# EasyEDA Pro project 计算器原理图_带PCB（嘉立创EDA专业版）.eprj

# Schematic 计算器原理图
Board Name: 计算器原理图; Create Date: 2024-10-13; Page Name: 计算器原理图; Project Name: 计算器原理图_带PCB（嘉立创EDA专业版）; Schematic Name: 计算器原理图; Update Date: 2025-01-02; Address1: *; Address2: *; Address3: *; Address4: *; Application_BuildNumber: *; ApprovedBy: *; Author: *; CheckedBy: *; CompanyName: *; CurrentDate: *; CurrentTime: *; Date: *; DocumentFullPathAndName: *; DocumentName: *; DocumentNumber: *; DrawnBy: *; Engineer: *; ImagePath: *; ModifiedDate: *; Organization: *; ProjectName: *; Revision: *; Rule: *; SheetNumber: 2; SheetTotal: 2; Time: *; Title: *
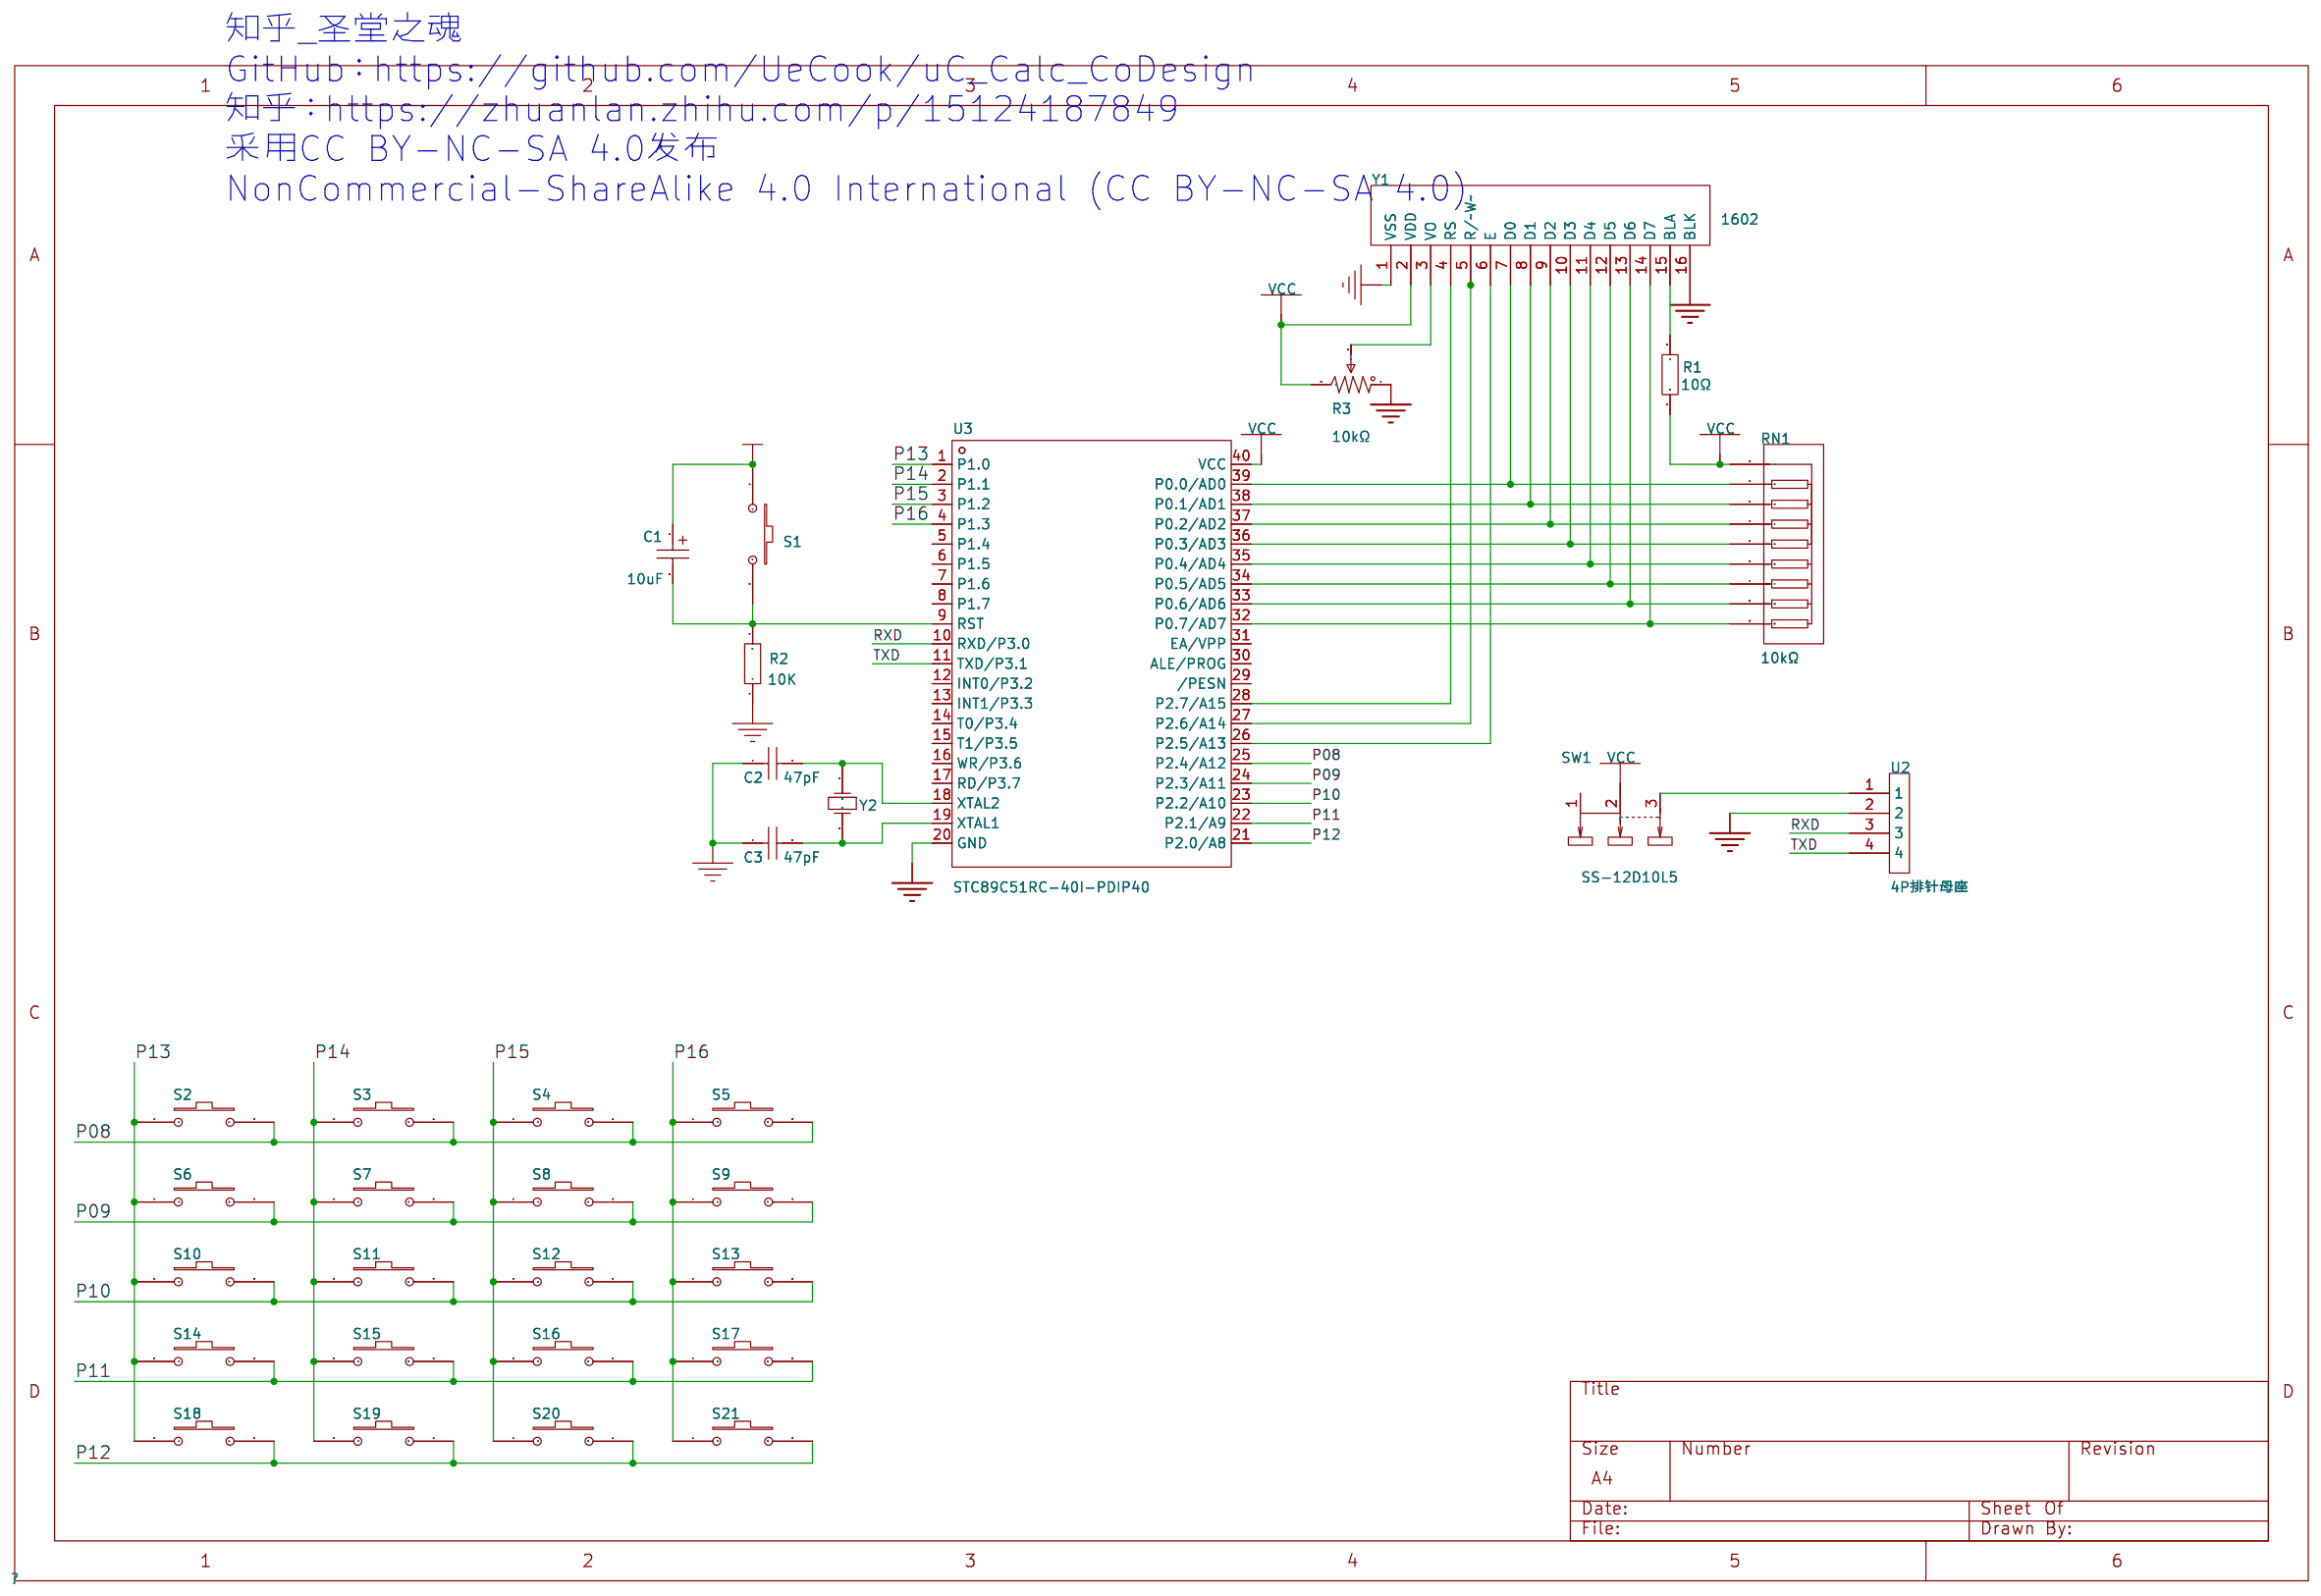
[diagram p0: schematic sheet]

## Parts
C1  10uF  [C0805]
C2  47pF  [C0805]
C3  47pF  [C0805]
R1  10Ω  [C0805]
R2  10K  [C0805]
R3  10kΩ  [RES-ADJ-TH_3362P]
RN1  10kΩ  [RES-ARRAY-TH_9P-P2.54-D1.0]
S1  按键  [SW-TH_4P-L6.0-W6.0-P4.50-LS6.5]
S2  按键  [SW-TH_4P-L6.0-W6.0-P4.50-LS6.5]
S3  按键  [SW-TH_4P-L6.0-W6.0-P4.50-LS6.5]
S4  按键  [SW-TH_4P-L6.0-W6.0-P4.50-LS6.5]
S5  按键  [SW-TH_4P-L6.0-W6.0-P4.50-LS6.5]
S6  按键  [SW-TH_4P-L6.0-W6.0-P4.50-LS6.5]
S7  按键  [SW-TH_4P-L6.0-W6.0-P4.50-LS6.5]
S8  按键  [SW-TH_4P-L6.0-W6.0-P4.50-LS6.5]
S9  按键  [SW-TH_4P-L6.0-W6.0-P4.50-LS6.5]
S10  按键  [SW-TH_4P-L6.0-W6.0-P4.50-LS6.5]
S11  按键  [SW-TH_4P-L6.0-W6.0-P4.50-LS6.5]
S12  按键  [SW-TH_4P-L6.0-W6.0-P4.50-LS6.5]
S13  按键  [SW-TH_4P-L6.0-W6.0-P4.50-LS6.5]
S14  按键  [SW-TH_4P-L6.0-W6.0-P4.50-LS6.5]
S15  按键  [SW-TH_4P-L6.0-W6.0-P4.50-LS6.5]
S16  按键  [SW-TH_4P-L6.0-W6.0-P4.50-LS6.5]
S17  按键  [SW-TH_4P-L6.0-W6.0-P4.50-LS6.5]
S18  按键  [SW-TH_4P-L6.0-W6.0-P4.50-LS6.5]
S19  按键  [SW-TH_4P-L6.0-W6.0-P4.50-LS6.5]
S20  按键  [SW-TH_4P-L6.0-W6.0-P4.50-LS6.5]
S21  按键  [SW-TH_4P-L6.0-W6.0-P4.50-LS6.5]
SW1  SS-12D10L5  [SW-TH_SS-12D10L5]
U2  4P排针母座  [HDR-TH_4P-P2.54-V-M-4]
U3  STC89C51RC-40I-PDIP40  [DIP-40_L52.3-W13.9-P2.54-LS15.2-BL]
Y1  1602  [LCD1602_1]
Y2  XTAL  [OSC-TH_L10.0-W4.5-P5.00]

## Library data of the parts
C1 = 10uF: Design Item ID: 电解电容; Library Name: 我的库
C2 C3 = 30P: Design Item ID: 瓷片电容; Library Name: 我的库
R1 = Res2: Resistor; Published: 8-Jun-2000; LatestRevisionDate: 17-Jul-2002; LatestRevisionNote: Re-released for DXP Platform.; PackageReference: AXIAL-0.4; Publisher: Altium Limited; Library Name: Miscellaneous Devices
R2 = 10K: Design Item ID: 电阻; Library Name: 我的库
R3 = 3362P-1-103: LCSC Part Name: 10kΩ ±10%; Supplier Part: C118956; Manufacturer: BOCHEN(博晨); Supplier Footprint: 插件; JLCPCB Part Class: Extended Part; Datasheet: https://atta.szlcsc.com/upload/public/pdf/source/20171114/C118956_15106326650691117445.pdf; Supplier: LCSC; Tolerance: ±10%; Temperature Coefficient: ±250ppm/℃
RN1 = A09-103JP: LCSC Part Name: 10kΩ ±5%; Supplier Part: C8692; Manufacturer: FH(风华); Supplier Footprint: SIP-9-2.54mm; JLCPCB Part Class: Extended Part; Datasheet: https://atta.szlcsc.com/upload/public/pdf/source/20140224/1457706855244.pdf; Supplier: LCSC; Tolerance: ±5%; Power(Watts): 125mW; Temperature Coefficient: ±100ppm/℃; Number of Resistors: 8; Number of Pins: 9
S1-S21 = 按键: Library Name: 我的库
SW1 = SS-12D10L5: LCSC Part Name: 插件大电流拨动开关; Supplier Part: C319012; Manufacturer: XKB Connectivity(中国星坤); Supplier Footprint: 插件; JLCPCB Part Class: Extended Part; Datasheet: https://atta.szlcsc.com/upload/public/pdf/source/20211009/D6412F37AABE6F9459A6EE7FA4DAEADB.pdf; Supplier: LCSC; Current Rating (DC): 3A; Voltage Rating (DC): 125V; Current Rating (AC): 3A; Voltage Rating (AC): 125V; Circuit: 单刀双掷; Mounting Style: 直插; Mechanical Life: 10000; Actuator Color: 黑色; Actuator Style: 矩形柱状; Pin Style: PC引脚; Operating Temperature: -40℃~+85℃; Switch Length: 13mm; Switch Width: 6.8mm; Switch Height: 6.4mm
U2 = 4P排针母座
U3 = STC89C51RC-40I-PDIP40: LCSC Part Name: STC89C51RC-40I-PDIP40 停产; Supplier Part: C29286; Manufacturer: STC(宏晶); Supplier Footprint: DIP-40; JLCPCB Part Class: Extended Part; Datasheet: https://atta.szlcsc.com/upload/public/pdf/source/20210111/C29286_8D18B35F9C74B93E8391CB56D361E797.pdf; Supplier: LCSC
Y1 = 1602: Library Name: 元件库
Y2 = XTAL: Library Name: 我的库

## Nets
GND: C2.1 C3.1 R2.1 R3.1 U2.2 U3.20(GND) Y1.1(VSS) Y1.16(BLK)
VCC: C1.1 R1.1 R3.3 RN1.1 S1.1 SW1.2 U3.40(VCC) Y1.2(VDD)
P08: S2.2 S3.2 S4.2 S5.2 U3.25(P2.4/A12)
P09: S6.2 S7.2 S8.2 S9.2 U3.24(P2.3/A11)
P10: S10.2 S11.2 S12.2 S13.2 U3.23(P2.2/A10)
P11: S14.2 S15.2 S16.2 S17.2 U3.22(P2.1/A9)
P12: S18.2 S19.2 S20.2 S21.2 U3.21(P2.0/A8)
P13: S2.1 S6.1 S10.1 S14.1 S18.1 U3.1(P1.0)
P14: S3.1 S7.1 S11.1 S15.1 S19.1 U3.2(P1.1)
P15: S4.1 S8.1 S12.1 S16.1 S20.1 U3.3(P1.2)
P16: S5.1 S9.1 S13.1 S17.1 S21.1 U3.4(P1.3)
RXD: U2.3 U3.10(RXD/P3.0)
TXD: U2.4 U3.11(TXD/P3.1)
$1N2: C3.2 U3.19(XTAL1) Y2.2(OSC2)
$1N3: C2.2 U3.18(XTAL2) Y2.1(OSC1)
$1N23: C1.2 R2.2 S1.2 U3.9(RST)
$1N53: U3.28(P2.7/A15) Y1.4(RS)
$1N55: U3.26(P2.5/A13) Y1.6(E)
$1N56: RN1.2 U3.39(P0.0/AD0) Y1.7(D0)
$1N57: RN1.3 U3.38(P0.1/AD1) Y1.8(D1)
$1N58: RN1.4 U3.37(P0.2/AD2) Y1.9(D2)
$1N59: RN1.5 U3.36(P0.3/AD3) Y1.10(D3)
$1N60: RN1.6 U3.35(P0.4/AD4) Y1.11(D4)
$1N61: RN1.7 U3.34(P0.5/AD5) Y1.12(D5)
$1N63: RN1.9 U3.32(P0.7/AD7) Y1.14(D7)
$1N2393: RN1.8 U3.33(P0.6/AD6) Y1.13(D6)
$1N4058: SW1.3 U2.1

Not connected (* = marked no-connect by the designer): R1 2; R3 2; SW1 1; U3 5(P1.4) 6(P1.5) 7(P1.6) 8(P1.7) 12(INT0/P3.2) 13(INT1/P3.3) 14(T0/P3.4) 15(T1/P3.5) 16(WR/P3.6) 17(RD/P3.7) 27(P2.6/A14) 29(/PESN) 30(ALE/PROG) 31(EA/VPP); Y1 3(VO) 5(R/~W~) 15(BLA)

## Notes on the sheet
- 知乎_圣堂之魂
  GitHub：https://github.com/UeCook/uC_Calc_CoDesign
  知乎：https://zhuanlan.zhihu.com/p/15124187849
  采用CC BY-NC-SA 4.0发布
  NonCommercial-ShareAlike 4.0 International (CC BY-NC-SA 4.0)

# Schematic 优雅版原理图
Create Date: 2024-10-15; Page Name: P1; Project Name: 计算器原理图_带PCB（嘉立创EDA专业版）; Schematic Name: 优雅版原理图; Update Date: 2025-01-02; Add into BOM: yes; Company: 嘉立创EDA; Convert to PCB: yes; Page Size: A4; Version: V1.0
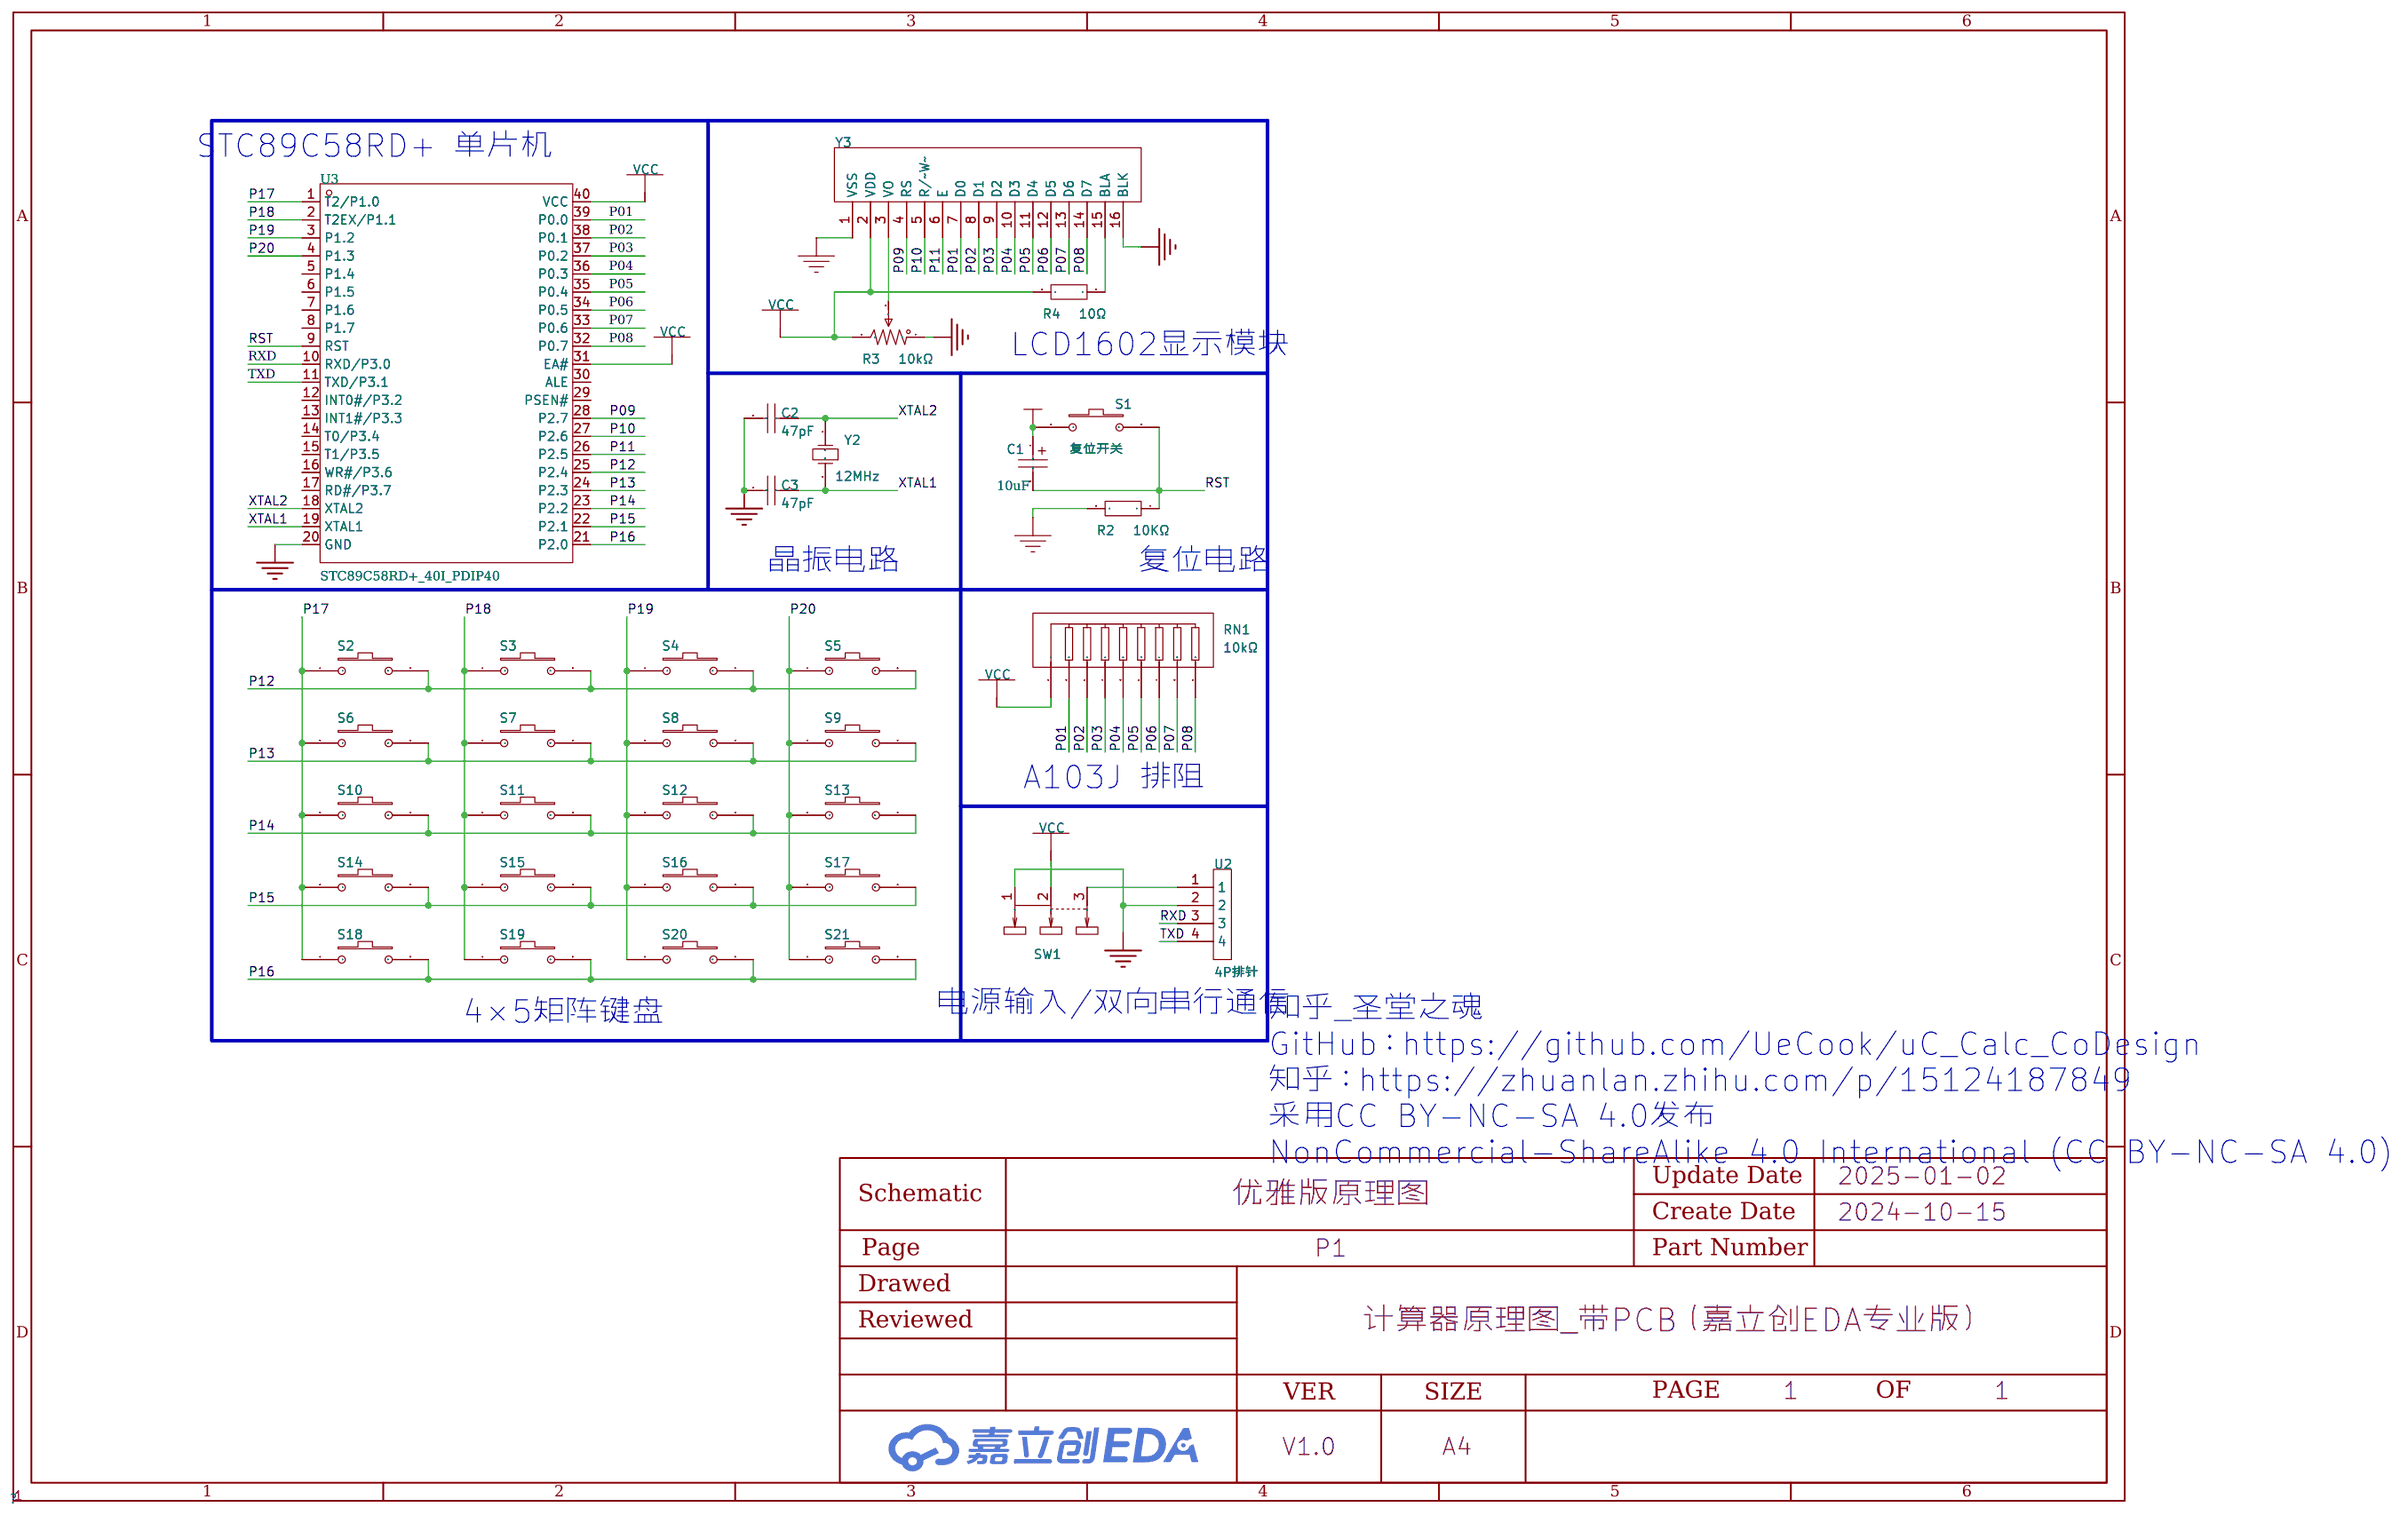
[diagram p1: schematic sheet]

## Parts
C1  10uF  [C0805]
C2  47pF  [C0805]
C3  47pF  [C0805]
R2  10KΩ  [C0805]
R3  10kΩ  [RES-ADJ-TH_3362P]
R4  10Ω  [C0805]
RN1  10kΩ  [RES-ARRAY-TH_9P-P2.54-D1.0]
S1  复位开关  [SW-TH_4P-L6.0-W6.0-P4.50-LS6.5]
S2  按键  [SW-TH_4P-L6.0-W6.0-P4.50-LS6.5]
S3  按键  [SW-TH_4P-L6.0-W6.0-P4.50-LS6.5]
S4  按键  [SW-TH_4P-L6.0-W6.0-P4.50-LS6.5]
S5  按键  [SW-TH_4P-L6.0-W6.0-P4.50-LS6.5]
S6  按键  [SW-TH_4P-L6.0-W6.0-P4.50-LS6.5]
S7  按键  [SW-TH_4P-L6.0-W6.0-P4.50-LS6.5]
S8  按键  [SW-TH_4P-L6.0-W6.0-P4.50-LS6.5]
S9  按键  [SW-TH_4P-L6.0-W6.0-P4.50-LS6.5]
S10  按键  [SW-TH_4P-L6.0-W6.0-P4.50-LS6.5]
S11  按键  [SW-TH_4P-L6.0-W6.0-P4.50-LS6.5]
S12  按键  [SW-TH_4P-L6.0-W6.0-P4.50-LS6.5]
S13  按键  [SW-TH_4P-L6.0-W6.0-P4.50-LS6.5]
S14  按键  [SW-TH_4P-L6.0-W6.0-P4.50-LS6.5]
S15  按键  [SW-TH_4P-L6.0-W6.0-P4.50-LS6.5]
S16  按键  [SW-TH_4P-L6.0-W6.0-P4.50-LS6.5]
S17  按键  [SW-TH_4P-L6.0-W6.0-P4.50-LS6.5]
S18  按键  [SW-TH_4P-L6.0-W6.0-P4.50-LS6.5]
S19  按键  [SW-TH_4P-L6.0-W6.0-P4.50-LS6.5]
S20  按键  [SW-TH_4P-L6.0-W6.0-P4.50-LS6.5]
S21  按键  [SW-TH_4P-L6.0-W6.0-P4.50-LS6.5]
SW1  SS-12D10L5  [SW-TH_SS-12D10L5]
U2  4P排针  [HDR-TH_4P-P2.54-V-M-4]
U3  STC89C58RD+_40I_PDIP40  [DIP-40_L52.0-W13.7-P2.54-LS15.2-BL]
Y2  12MHz  [OSC-TH_L10.0-W4.5-P5.00]
Y3  1602  [LCD1602_1]

## Library data of the parts
C1 = 10uF: Design Item ID: 电解电容; Library Name: 我的库
C2 C3 = CL21C470JBANNNC: LCSC Part Name: 47pF ±5% 50V; Supplier Part: C14857; Manufacturer: SAMSUNG(三星); Supplier Footprint: 0805; JLCPCB Part Class: Basic Part; Datasheet: https://atta.szlcsc.com/upload/public/pdf/source/20160103/1457707672155.pdf; Supplier: LCSC; Tolerance: ±5%; Voltage Rated: 50V; Temperature Coefficient: C0G
R2 = 10K: Design Item ID: 电阻; Library Name: 我的库
R3 = 3362P-1-103: LCSC Part Name: 10kΩ ±10%; Supplier Part: C118956; Manufacturer: BOCHEN(博晨); Supplier Footprint: 插件; JLCPCB Part Class: Extended Part; Datasheet: https://atta.szlcsc.com/upload/public/pdf/source/20171114/C118956_15106326650691117445.pdf; Supplier: LCSC; Tolerance: ±10%; Temperature Coefficient: ±250ppm/℃
R4 = Res2: Resistor; Published: 8-Jun-2000; LatestRevisionDate: 17-Jul-2002; LatestRevisionNote: Re-released for DXP Platform.; PackageReference: AXIAL-0.4; Publisher: Altium Limited; Library Name: Miscellaneous Devices
RN1 = A09-103JP: LCSC Part Name: 10kΩ ±5%; Supplier Part: C8692; Manufacturer: FH(风华); Supplier Footprint: SIP-9-2.54mm; JLCPCB Part Class: Extended Part; Datasheet: https://atta.szlcsc.com/upload/public/pdf/source/20140224/1457706855244.pdf; Supplier: LCSC; Tolerance: ±5%; Power(Watts): 125mW; Temperature Coefficient: ±100ppm/℃; Number of Resistors: 8; Number of Pins: 9
S1-S21 = 按键: Library Name: 我的库
SW1 = SS-12D10L5: LCSC Part Name: 插件大电流拨动开关; Supplier Part: C319012; Manufacturer: XKB Connectivity(中国星坤); Supplier Footprint: 插件; JLCPCB Part Class: Extended Part; Datasheet: https://atta.szlcsc.com/upload/public/pdf/source/20211009/D6412F37AABE6F9459A6EE7FA4DAEADB.pdf; Supplier: LCSC; Current Rating (DC): 3A; Voltage Rating (DC): 125V; Current Rating (AC): 3A; Voltage Rating (AC): 125V; Circuit: 单刀双掷; Mounting Style: 直插; Mechanical Life: 10000; Actuator Color: 黑色; Actuator Style: 矩形柱状; Pin Style: PC引脚; Operating Temperature: -40℃~+85℃; Switch Length: 13mm; Switch Width: 6.8mm; Switch Height: 6.4mm
U2 = 4P排针母座
U3 = STC89C52RC-40I-PDIP40: Supplier Part: C14022; Manufacturer: STC(宏晶); Supplier Footprint: DIP-40; JLCPCB Part Class: Extended Part; Datasheet: https://atta.szlcsc.com/upload/public/pdf/source/20210104/C14022_3E6032FDBB5DBC6F971AD019A8472F5B.pdf; Supplier: LCSC; CPU Core: 51系列; Supply Voltage Range: 3.3V~5.5V; Program FLASH Size: 8KB; RAM Size: 512Byte; EEPROM/Data FLASH Size: 4KB; GPIO Ports Number: 35; 16Bit Timer Number: 3; U(S)ART Number: 1; Peripherals / Functions / Protocol Stacks: 看门狗; Operating Temperature Range: -40℃~+85℃
Y2 = XTAL: Library Name: 我的库
Y3 = 1602: Library Name: 元件库

## Nets
GND: C2.1 C3.1 R2.2 R3.1 SW1.1 U2.2 U3.20(GND) Y3.1(VSS) Y3.16(BLK)
VCC: C1.1 R3.3 R4.2 RN1.1 S1.1 SW1.2 U3.31(EA#) U3.40(VCC) Y3.2(VDD)
P01: RN1.2 U3.39(P0.0) Y3.7(D0)
P02: RN1.3 U3.38(P0.1) Y3.8(D1)
P03: RN1.4 U3.37(P0.2) Y3.9(D2)
P04: RN1.5 U3.36(P0.3) Y3.10(D3)
P05: RN1.6 U3.35(P0.4) Y3.11(D4)
P06: RN1.7 U3.34(P0.5) Y3.12(D5)
P07: RN1.8 U3.33(P0.6) Y3.13(D6)
P08: RN1.9 U3.32(P0.7) Y3.14(D7)
P09: U3.28(P2.7) Y3.4(RS)
P10: U3.27(P2.6) Y3.5(R/~W~)
P11: U3.26(P2.5) Y3.6(E)
P12: S2.2 S3.2 S4.2 S5.2 U3.25(P2.4)
P13: S6.2 S7.2 S8.2 S9.2 U3.24(P2.3)
P14: S10.2 S11.2 S12.2 S13.2 U3.23(P2.2)
P15: S14.2 S15.2 S16.2 S17.2 U3.22(P2.1)
P16: S18.2 S19.2 S20.2 S21.2 U3.21(P2.0)
P17: S2.1 S6.1 S10.1 S14.1 S18.1 U3.1(T2/P1.0)
P18: S3.1 S7.1 S11.1 S15.1 S19.1 U3.2(T2EX/P1.1)
P19: S4.1 S8.1 S12.1 S16.1 S20.1 U3.3(P1.2)
P20: S5.1 S9.1 S13.1 S17.1 S21.1 U3.4(P1.3)
RST: C1.2 R2.1 S1.2 U3.9(RST)
RXD: U2.3 U3.10(RXD/P3.0)
TXD: U2.4 U3.11(TXD/P3.1)
XTAL1: C3.2 U3.19(XTAL1) Y2.2(OSC2)
XTAL2: C2.2 U3.18(XTAL2) Y2.1(OSC1)
Net-(R4-1): R4.1 Y3.15(BLA)
Net-(SW1-3): SW1.3 U2.1

Not connected (* = marked no-connect by the designer): R3 2; U3 5(P1.4) 6(P1.5) 7(P1.6) 8(P1.7) 12(INT0#/P3.2) 13(INT1#/P3.3) 14(T0/P3.4) 15(T1/P3.5) 16(WR#/P3.6) 17(RD#/P3.7) 29(PSEN#) 30(ALE); Y3 3(VO)

## Notes on the sheet
- STC89C58RD+ 单片机
- LCD1602显示模块
- 晶振电路
- 复位电路
- A103J 排阻
- 4×5矩阵键盘
- 电源输入/双向串行通信
- 知乎_圣堂之魂
  GitHub：https://github.com/UeCook/uC_Calc_CoDesign
  知乎：https://zhuanlan.zhihu.com/p/15124187849
  采用CC BY-NC-SA 4.0发布
  NonCommercial-ShareAlike 4.0 International (CC BY-NC-SA 4.0)

# Board PCB
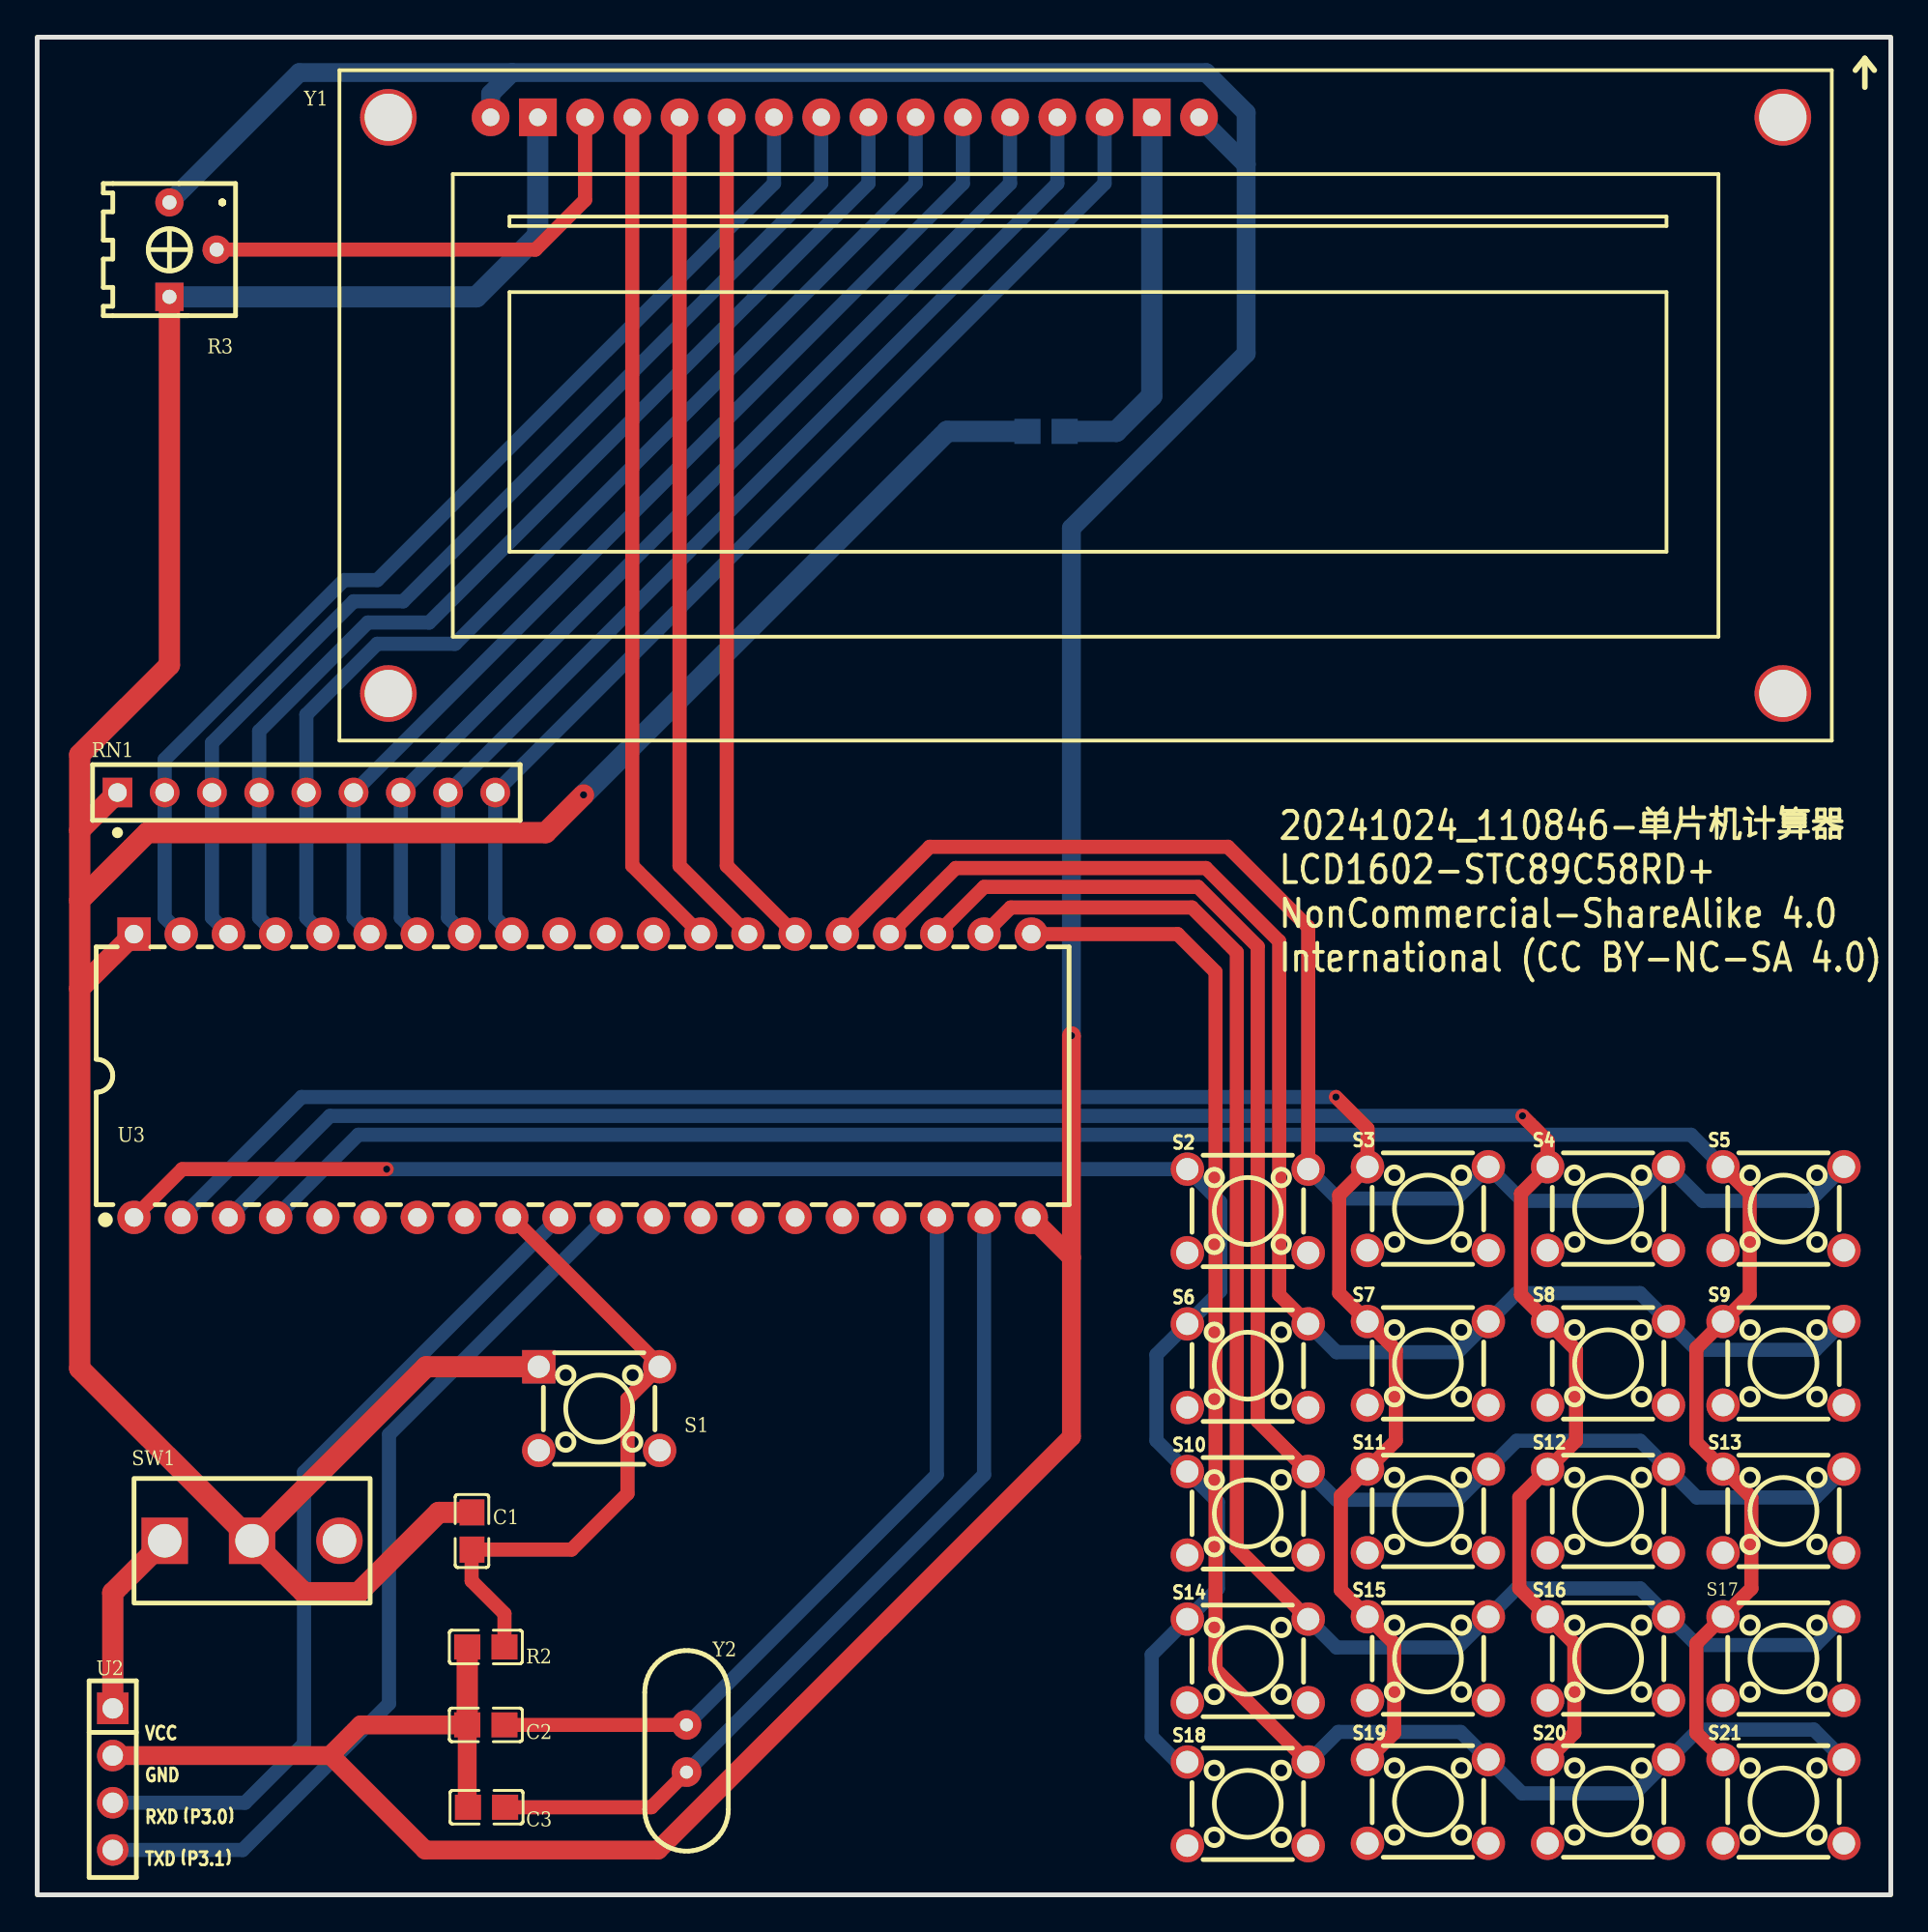
[diagram p2: board, top side]
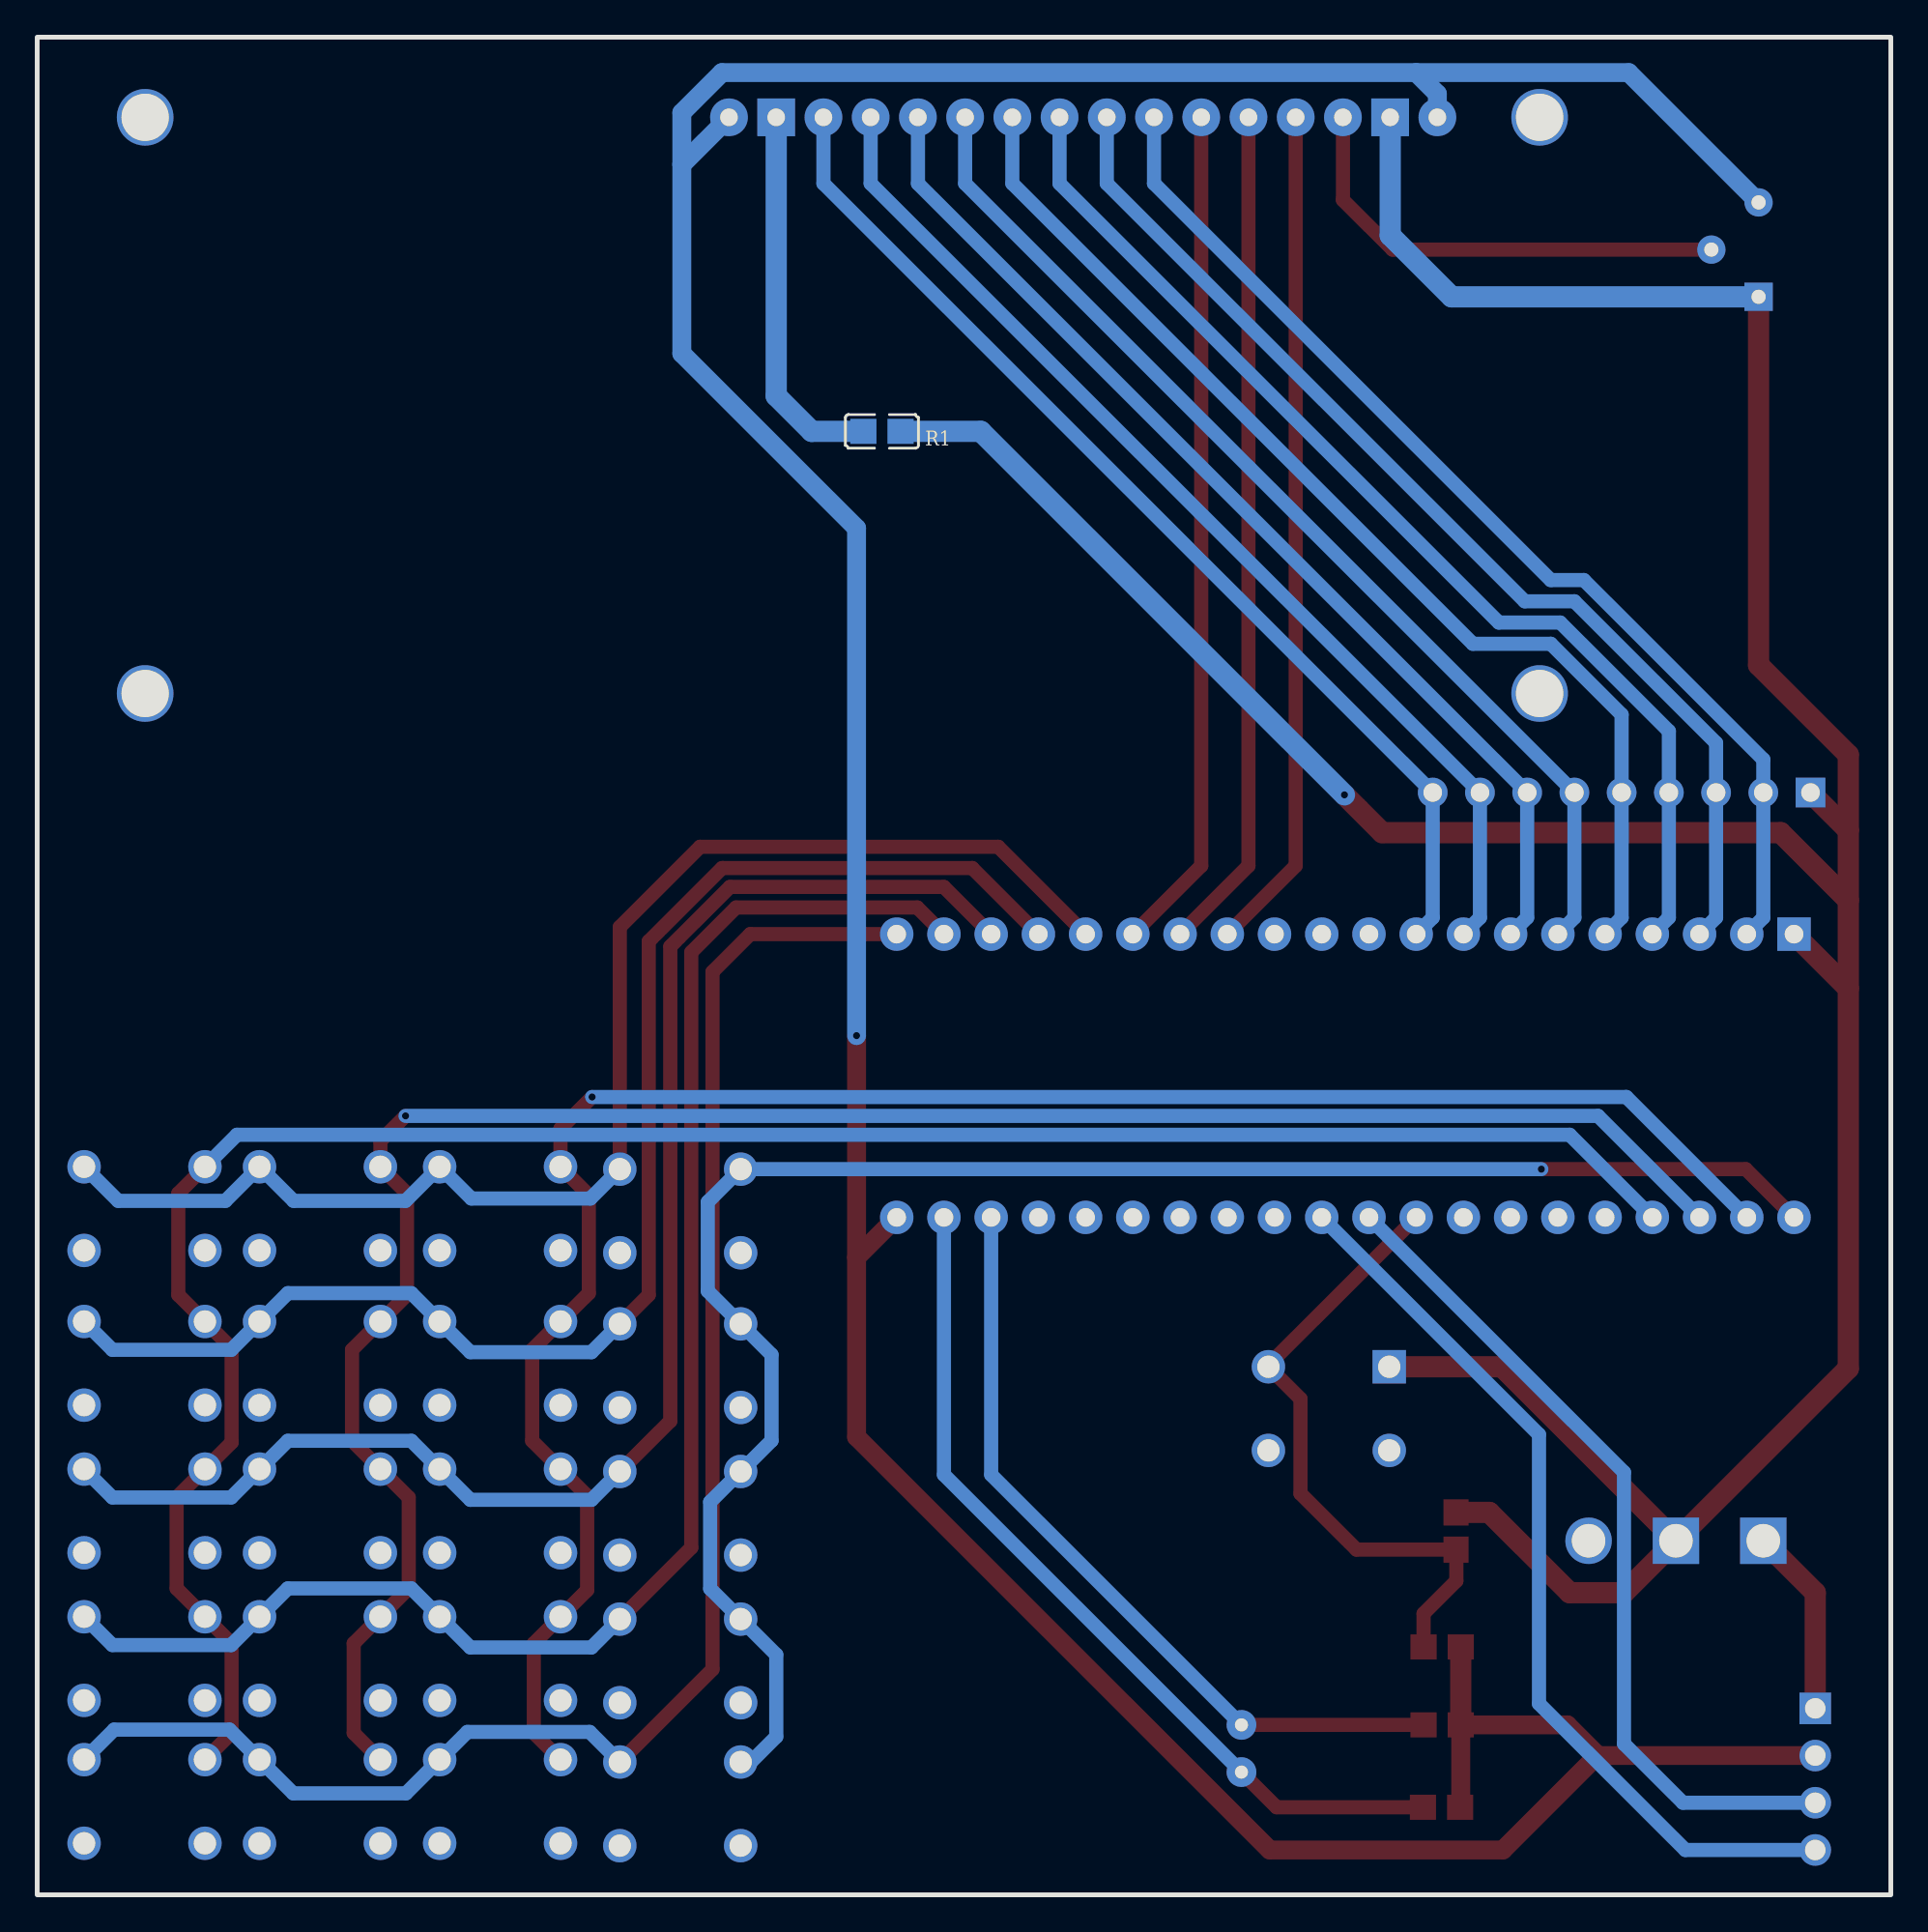
[diagram p3: board, bottom side, seen from below]

Outline 99.69 x 99.95 mm; copper layers: Top Layer, Bottom Layer. Coordinates in mm from the lower left corner of the outline.
Outline path: rectangle 0,99.95 99.69,0
Stack: Top Layer 0.035mm / Dielectric1 1.51mm FR4 er 4.5 / Bottom Layer 0.035mm

## Design rules (mm)
template: 自定义配置
spacing copperThickness1oz (default): track to track 0.254, other pairs 0.152 to 0.3
spacing copperThickness2oz: track to track 0.203, other pairs 0.152 to 0.3
track width ALL (default): min 0.762, default 0.762, max 1.27
track width GND: min 0.762, default 1.016, max 1.27
track width VCC: min 1.143, default 1.143, max 1.27
differential pair differentialPair (default): width min 0.127, default 0.254, max 2.54; gap min 0.152, default 0.152
via viaSize (default): diameter min 0.66, default 0.66, max 10; hole min 0.381, default 0.381, max 6.299

## Placement (name value [footprint] x y rotation side)
C1  10uF  [C0805]  23.38 19.57 270 top
C2  47pF  [C0805]  24.13 9.14 0 top
C3  47pF  [C0805]  24.17 4.71 0 top
R1  10Ω  [C0805]  54.26 78.74 0 bottom
R2  10K  [C0805]  24.13 13.34 0 top
R3  10kΩ  [RES-ADJ-TH_3362P]  8.38 88.52 270 top
RN1  10kΩ  [RES-ARRAY-TH_9P-P2.54-D1.0]  14.48 59.31 0 top
S1  按键  [SW-TH_4P-L6.0-W6.0-P4.50-LS6.5]  30.23 26.16 0 top
S2  按键  [SW-TH_4P-L6.0-W6.0-P4.50-LS6.5#2]  65.11 36.79 0 top
S3  按键  [SW-TH_4P-L6.0-W6.0-P4.50-LS6.5#2]  74.8 36.92 0 top
S4  按键  [SW-TH_4P-L6.0-W6.0-P4.50-LS6.5#2]  84.49 36.92 0 top
S5  按键  [SW-TH_4P-L6.0-W6.0-P4.50-LS6.5#2]  93.92 36.92 0 top
S6  按键  [SW-TH_4P-L6.0-W6.0-P4.50-LS6.5#2]  65.11 28.47 0 top
S7  按键  [SW-TH_4P-L6.0-W6.0-P4.50-LS6.5#2]  74.8 28.6 0 top
S8  按键  [SW-TH_4P-L6.0-W6.0-P4.50-LS6.5#2]  84.49 28.6 0 top
S9  按键  [SW-TH_4P-L6.0-W6.0-P4.50-LS6.5#2]  93.92 28.6 0 top
S10  按键  [SW-TH_4P-L6.0-W6.0-P4.50-LS6.5#2]  65.11 20.53 0 top
S11  按键  [SW-TH_4P-L6.0-W6.0-P4.50-LS6.5#2]  74.8 20.66 0 top
S12  按键  [SW-TH_4P-L6.0-W6.0-P4.50-LS6.5#2]  84.49 20.66 0 top
S13  按键  [SW-TH_4P-L6.0-W6.0-P4.50-LS6.5#2]  93.92 20.66 0 top
S14  按键  [SW-TH_4P-L6.0-W6.0-P4.50-LS6.5#2]  65.11 12.59 0 top
S15  按键  [SW-TH_4P-L6.0-W6.0-P4.50-LS6.5#2]  74.8 12.71 0 top
S16  按键  [SW-TH_4P-L6.0-W6.0-P4.50-LS6.5#2]  84.49 12.71 0 top
S17  按键  [SW-TH_4P-L6.0-W6.0-P4.50-LS6.5#2]  93.92 12.71 0 top
S18  按键  [SW-TH_4P-L6.0-W6.0-P4.50-LS6.5#2]  65.11 4.9 0 top
S19  按键  [SW-TH_4P-L6.0-W6.0-P4.50-LS6.5#2]  74.8 5.02 0 top
S20  按键  [SW-TH_4P-L6.0-W6.0-P4.50-LS6.5#2]  84.49 5.02 0 top
S21  按键  [SW-TH_4P-L6.0-W6.0-P4.50-LS6.5#2]  93.92 5.02 0 top
SW1  SS-12D10L5  [SW-TH_SS-12D10L5]  11.56 19.05 180 top
U2  4P排针母座  [HDR-TH_4P-P2.54-V-M-4]  4.06 6.22 270 top
U3  STC89C51RC-40I-PDIP40  [DIP-40_L52.3-W13.9-P2.54-LS15.2-BL]  29.34 44.07 0 top
Y1  1602  [LCD1602_1]  56.39 80.14 0 top
Y2  XTAL  [OSC-TH_L10.0-W4.5-P5.00]  34.92 7.75 0 top

## Footprints (pads in the part's own frame, mm; a bottom-side part is the same pattern mirrored in y, then rotated)
C0805
  rect 1.41x1.35 smd: 1(-1,0) 2(1,0)
DIP-40_L52.3-W13.9-P2.54-LS15.2-BL
  round 1.801 hole 1.001: 1(-24.13,-7.62) 2(-21.59,-7.62) 3(-19.05,-7.62) 4(-16.51,-7.62) 5(-13.97,-7.62) 6(-11.43,-7.62) 7(-8.89,-7.62) 8(-6.35,-7.62) 9(-3.81,-7.62) 10(-1.27,-7.62) 11(1.27,-7.62) 12(3.81,-7.62) 13(6.35,-7.62) 14(8.89,-7.62) 15(11.43,-7.62) 16(13.97,-7.62) 17(16.51,-7.62) 18(19.05,-7.62) 19(21.59,-7.62) 20(24.13,-7.62) 21(24.13,7.62) 22(21.59,7.62) 23(19.05,7.62) 24(16.51,7.62) 25(13.97,7.62) 26(11.43,7.62) 27(8.89,7.62) 28(6.35,7.62) 29(3.81,7.62) 30(1.27,7.62) 31(-1.27,7.62) 32(-3.81,7.62) 33(-6.35,7.62) 34(-8.89,7.62) 35(-11.43,7.62) 36(-13.97,7.62) 37(-16.51,7.62) 38(-19.05,7.62) 39(-21.59,7.62)
  rect 1.801x1.801 hole 1.001: 40(-24.13,7.62)
HDR-TH_4P-P2.54-V-M-4
  rect 1.7x1.7 hole 1.1: 1(-3.81,0)
  round 1.7 hole 1.1: 2(-1.27,0) 3(1.27,0) 4(3.81,0)
LCD1602_1
  round 3.048 hole 2.545x2.54: 0(-37.5,15.5) 0(-37.5,-15.5) 0(37.5,15.5) 0(37.5,-15.5)
  round 2.032 hole 0.945: 1(-32,15.5) 3(-26.92,15.5) 4(-24.38,15.5) 5(-21.84,15.5) 6(-19.3,15.5) 7(-16.76,15.5) 8(-14.22,15.5) 9(-11.68,15.5) 10(-9.14,15.5) 11(-6.6,15.5) 12(-4.06,15.5) 13(-1.52,15.5) 14(1.02,15.5) 16(6.1,15.5)
  rect 2.032x2.032 hole 0.945: 2(-29.46,15.5) 15(3.56,15.5)
OSC-TH_L10.0-W4.5-P5.00
  round 1.6 hole 0.701: 1(0,1.397) 2(0,-1.143)
RES-ADJ-TH_3362P
  round 1.524 hole 0.762: 1(-2.54,-1.27) 2(0,1.27)
  rect 1.524x1.524 hole 0.762: 3(2.54,-1.27)
RES-ARRAY-TH_9P-P2.54-D1.0
  rect 1.6x1.6 hole 1: 1(-10.16,0)
  round 1.6 hole 1: 2(-7.62,0) 3(-5.08,0) 4(-2.54,0) 5(0,0) 6(2.54,0) 7(5.08,0) 8(7.62,0) 9(10.16,0)
SW-TH_4P-L6.0-W6.0-P4.50-LS6.5
  rect 1.8x1.8 hole 1.2: 1(-3.25,2.25)
  round 1.8 hole 1.2: 2(3.25,2.25) 3(-3.25,-2.25) 4(3.25,-2.25)
SW-TH_4P-L6.0-W6.0-P4.50-LS6.5#2
  round 1.8 hole 1.2: 1(-3.25,2.25) 2(3.25,2.25) 3(-3.25,-2.25) 4(3.25,-2.25)
SW-TH_SS-12D10L5
  round 2.499 hole 1.801: 1(-4.699,0)
  rect 2.499x2.499 hole 1.801: 2(0,0) 3(4.699,0)

## Nets
As in the schematic, except:
$1N18: R1.2 Y1.15
$1N2383: U3.27 Y1.5
$1N4087: R3.2 Y1.3

Pads without a net: S1 3 4; S2 3 4; S3 3 4; S4 3 4; S5 3 4; S6 3 4; S7 3 4; S8 3 4; S9 3 4; S10 3 4; S11 3 4; S12 3 4; S13 3 4; S14 3 4; S15 3 4; S16 3 4; S17 3 4; S18 3 4; S19 3 4; S20 3 4; S21 3 4; SW1 1; U3 5 6 7 8 12 13 14 15 16 17 29 30 31; Y1 0

## Via types
v1: diameter 1, hole 0.381, Top Layer to Bottom Layer, 1 via
v2: diameter 0.8, hole 0.381, Top Layer to Bottom Layer, 1 via
v3: diameter 0.66, hole 0.381, Top Layer to Bottom Layer, 3 vias

## Routing (per net, layer and track width the routed paths; a pad name or vN(x,y) marks a point on that pad's centre or on a via; arc(x,y) is an arc through that point)
GND: length 226
  Top Layer w1.016: 15.79,7.49 15.79,7.53 17.4,9.14 C2.1 23.13,4.75 C3.1 23.17,4.64 ; 15.79,7.49 U2.2 ; 15.79,7.49 20.87,2.41 33.4,2.41 55.63,24.64 55.63,34.29 ; 55.63,34.29 U3.20 ; 55.63,34.29 v2(55.63,46.23)
  Top Layer w1.143: R2.1 C2.1
  Bottom Layer w1.016: 25.53,98.04 24.39,96.9 Y1.1 ; 25.53,98.04 62.87,98.04 65.02,95.89 65.02,93.1 ; 25.53,98.04 14.1,98.04 R3.1 ; Y1.16 62.49,95.62 65.01,93.1 65.02,93.1 ; v2(55.63,46.23) 55.63,73.53 65.02,82.93 65.02,93.1
VCC: length 202.8
  Top Layer w1.143: 2.29,53.51 5.93,57.15 27.35,57.15 v1(29.38,59.18) ; 2.29,53.51 2.29,57.28 ; 2.29,53.51 2.29,48.77 ; 2.29,57.28 2.29,61.34 7.11,66.17 R3.3 ; 2.29,57.28 RN1.1 ; U3.40 2.29,48.77 ; 2.29,48.77 2.29,28.32 SW1.2 ; SW1.2 14.35,16.26 17.27,16.26 21.59,20.57 C1.1 ; SW1.2 20.92,28.41 S1.1
  Bottom Layer w1.143: R1.1 48.94,78.74 v1(29.38,59.18) ; Y1.2 26.92,95.63 26.92,89.28 23.62,85.98 R3.3
P08: length 75
  Top Layer w0.762: S2.2 68.36,52.07 64.04,56.39 48.01,56.39 U3.25
  Bottom Layer w0.762: S2.2 69.94,37.47 76.34,37.47 S3.2 79.88,37.34 85.9,37.34 S4.2 89.57,37.34 95.34,37.34 S5.2
P09: length 77.9
  Top Layer w0.762: S6.2 66.8,32.28 66.8,51.3 62.86,55.25 49.4,55.25 45.85,51.69
  Bottom Layer w0.762: S9.2 95.65,29.32 89.26,29.32 S8.2 86.21,32.37 79.57,32.37 S7.2 76.4,29.2 69.88,29.2 S6.2
P10: length 81.7
  Top Layer w0.762: U3.23 50.93,54.23 62.44,54.23 65.64,51.02 65.64,25.49 S10.2
  Bottom Layer w0.762: 97.17,22.9 95.65,21.38 89.26,21.38 86.21,24.43 79.57,24.43 76.4,21.25 69.88,21.25 S10.2
P11: length 85.3
  Top Layer w0.762: U3.22 52.36,53.12 62.11,53.12 64.52,50.71 64.52,18.68 S14.2
  Bottom Layer w0.762: S14.2 69.88,13.31 76.4,13.31 S15.2 79.57,16.49 86.21,16.49 S16.2 89.26,13.44 95.65,13.44 S17.2
P12: length 88.3
  Top Layer w0.762: S18.2 63.37,12.13 63.37,49.66 61.34,51.69 U3.21
  Bottom Layer w0.762: S18.2 69.98,8.76 76.56,8.76 S19.2 79.86,5.46 85.93,5.46 S20.2 89.35,8.89 95.56,8.89 S21.2
P13: length 95.7
  Top Layer w0.762: U3.1 7.8,39.04 v3(18.8,39.04)
  Bottom Layer w0.762: v3(18.8,39.04) S2.1 63.63,37.28 63.63,32.49 S6.1 60.2,29.06 60.2,24.44 S10.1 63.5,21.14 63.5,16.48 S14.1 59.94,12.92 59.94,8.51 61.31,7.15 S18.1
P14: length 106
  Top Layer w0.762: S19.1 72.98,8.71 72.98,13.53 S15.1 70.12,16.4 70.12,21.47 71.55,22.9 73.07,24.43 73.07,29.32 S7.1 70.03,32.37 70.03,37.65 S3.1 71.55,41.23 v3(69.85,42.93)
  Bottom Layer w0.762: 7.75,36.45 14.22,42.93 v3(69.85,42.93)
P15: length 112
  Top Layer w0.762: v3(79.88,41.91) 81.24,40.56 S4.1 79.8,37.74 79.8,32.28 S8.1 82.76,29.32 82.76,24.43 79.71,21.38 79.71,16.49 S16.1 82.67,13.53 82.67,8.71 S20.1
  Bottom Layer w0.762: v3(79.88,41.91) 15.75,41.91 U3.3
P16: length 117.1
  Top Layer w0.762: S21.1 89.24,8.71 89.24,13.53 S17.1 92.2,16.49 92.2,21.38 89.24,24.34 89.24,29.41 S9.1 92.11,32.28 92.11,37.74 S5.1
  Bottom Layer w0.762: S5.1 88.95,40.89 17.27,40.89 12.83,36.45
RXD: length 45.6
  Bottom Layer w0.762: 28.07,36.45 14.35,22.73 14.35,8.13 11.18,4.95 U2.3
TXD: length 49.1
  Bottom Layer w0.762: U3.11 18.92,24.77 18.92,10.29 11.05,2.41 U2.4
$1N2: length 47
  Top Layer w0.762: Y2.2 33.03,4.71 C3.2
  Bottom Layer w0.762: Y2.2 50.93,22.61 U3.19
$1N3: length 42.7
  Top Layer w0.762: C2.2 Y2.1
  Bottom Layer w0.762: U3.18 48.39,22.61 Y2.1
$1N18: length 20.5
  Bottom Layer w1.143: Y1.15 59.95,80.65 58.04,78.74 R1.2
$1N23: length 34.5
  Top Layer w0.762: U3.9 33.52,28.46 31.75,26.69 31.75,21.59 28.73,18.57 C1.2 23.37,18.56 23.37,16.89 25.13,15.13 R2.2
$1N53: length 45.5
  Top Layer w0.762: U3.28 32.01,55.37 Y1.4
$1N55: length 45.5
  Top Layer w0.762: Y1.6 37.09,55.37 U3.26
$1N56: length 58.9
  Bottom Layer w0.762: 7.75,51.69 6.86,52.58 RN1.2 6.86,61.09 16.51,70.74 18.29,70.74 39.63,92.08 Y1.7
$1N57: length 59.5
  Bottom Layer w0.762: U3.38 9.4,52.58 RN1.3 9.4,61.98 17.02,69.6 19.69,69.6 42.17,92.08 Y1.8
$1N58: length 59.8
  Bottom Layer w0.762: Y1.9 44.71,92.08 21.08,68.45 17.78,68.45 11.94,62.61 RN1.4 11.94,52.58 12.83,51.69
$1N59: length 60.3
  Bottom Layer w0.762: Y1.10 47.25,92.08 22.48,67.31 18.29,67.31 14.48,63.5 RN1.5 14.48,52.58 U3.36
$1N60: length 57.9
  Bottom Layer w0.762: 17.91,51.69 17.02,52.58 RN1.6 49.79,92.08 Y1.11
$1N61: length 57.9
  Bottom Layer w0.762: Y1.12 52.32,95.63 52.32,92.08 RN1.7 19.56,52.58 20.45,51.69
$1N63: length 57.9
  Bottom Layer w0.762: U3.32 24.64,52.58 RN1.9 57.41,92.08 Y1.14
$1N2383: length 45.5
  Top Layer w0.762: Y1.5 34.55,55.37 U3.27
$1N2393: length 57.9
  Bottom Layer w0.762: U3.33 22.1,52.58 RN1.8 54.87,92.08 Y1.13
$1N4058: length 10.2
  Top Layer w1.143: U2.1 4.06,16.26 SW1.3
$1N4087: length 25.4
  Top Layer w0.762: R3.2 26.8,88.52 29.47,91.19 Y1.3

## Text on the board
Top Silkscreen Layer: VCC / GND / RXD（P3.0） / TXD（P3.1） | 20241024_110846-单片机计算器 / LCD1602-STC89C58RD+ / NonCommercial-ShareAlike 4.0 / International (CC BY-NC-SA 4.0)
